# Altium schematic sheet Differentiator.SchDoc
size A; SheetNumber: 6; SheetTotal: 8
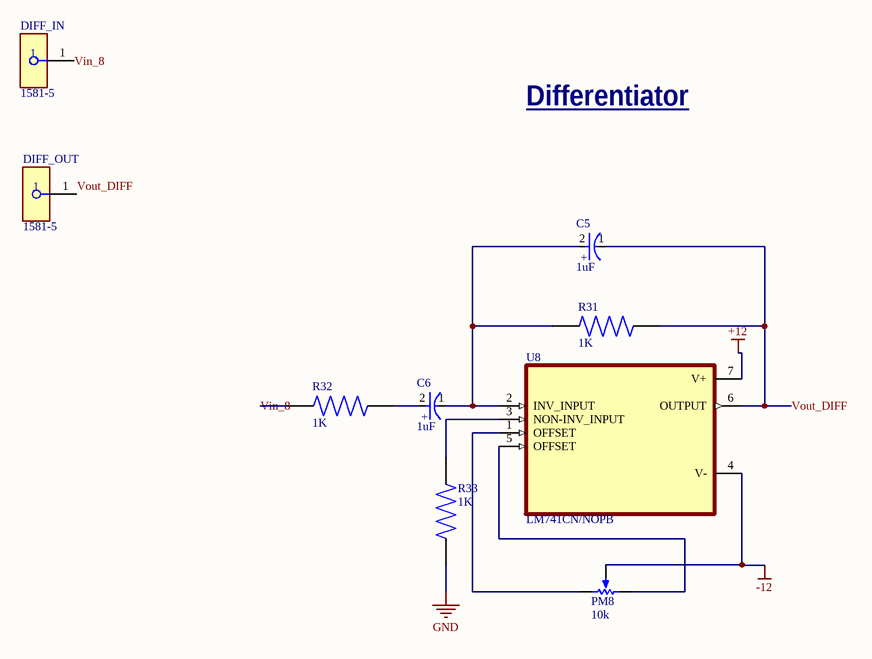
[diagram p0: Differentiator.SchDoc]

## Parts
C5  1uF  [FP-ECA-2CHG010I-MFG]
C6  1uF  [FP-ECA-2CHG010I-MFG]
DIFF_IN  1581-5  [FP-1581-5-MFG]
DIFF_OUT  1581-5  [FP-1581-5-MFG]
PM8  10k  [BOUR-3362P]
R31  1K  [RESAD1100W55L680D260]
R32  1K  [RESAD1100W55L680D260]
R33  1K  [RESAD1100W55L680D260]
U8  LM741CN/NOPB  [DIP794W45P254L959H508Q8]

## Nets
+12: U8.7(V+)
-12: PM8.2(S) U8.4(V-)
GND: R33.1
Vin_8: DIFF_IN.1 R32.1
Vout_DIFF: C5.1(C) DIFF_OUT.1 R31.2 U8.6(OUTPUT)
NetC5_2: C5.2(A) C6.1(C) R31.1 U8.2(INV_INPUT)
NetC6_2: C6.2(A) R32.2
NetPM8_1: PM8.1(CCW) U8.5(OFFSET)
NetPM8_3: PM8.3(CW) U8.1(OFFSET)
NetR33_2: R33.2 U8.3(NON-INV_INPUT)

## Notes on the sheet
- Differentiator
- (in symbol CMP-05427-002176-1) +

## Library data of the parts
C5 C6 = CMP-05427-002176-1: CAP ALUM 1UF 20% 160V RADIAL; Lead/Base Style: Straight; Ripple Current: 17mA; Life (Hours): 2000Hour; Voltage Rating (DC): 160V; Max Operating Temperature: 105°C; Radiation Hardening: No; Min Operating Temperature: -25°C; Packaging: Ammo Pack; Series: NHG; Capacitance: 1uF; Height - Seated (Max): 0.48inch; Lead Pitch: 2.5mm; Diameter: 6.3mm; Length: 11.2mm; Package Quantity: 2000; Termination: Radial; RoHS Compliant: Yes; Voltage Rating: 160V; Tolerance: 20%; Height: 11.2mm; Case/Package: Radial; Mount: Through Hole
DIFF_IN DIFF_OUT = CMP-73906-000011-1: CONN BANANA JACK TURRET GREEN; Body Material: PC; Number of Contacts: 1; Max Current Rating: 15A; Voltage Rating (AC): 30V; Insulation: Mating End Insulated; Voltage Rating: 2.5kV; Voltage Rating (DC): 60V; Gender: Female; Height: 0.25inch; Mount: Panel; RoHS Compliant: Yes; Length: 1.22inch; Orientation: Straight; Diameter: 4.22mm; Lead Free: Lead Free; Package Quantity: 1; Termination: Turret; Current Rating: 15A; Packaging: Bag; Series: 1581; REACH SVHC: No SVHC; Number of Positions: 1; Contact Plating: Tin; Housing Color: Green; Contact Material: Brass; Insulation Material: Polycarbonate; Weight: 0.126lb; Number of Ports: 1; Color: Green; Housing Material: Polycarbonate; Width: 4inch
PM8 = CMP-1747-00004-1: Square Trimpot(R) Trimming Potentiometer, 10 KOhm, 300 V, -55 to 125 degC, 3-Pin THD, RoHS, Tube; Voltage Rating: 220 mV; Power Rating: 1 W; Tolerance: 1%; Resistance: 50 mohm; Case/Package: 1206; Length: 3.2 mm; RoHSCompliant: True; PackageDescription: 3-Pin Through Hole Device, Body 6.6 x 6.99 mm, Pitch 2.54 mm; ComponentLink2Description: Datasheet; REACH SVHC: No SVHC; Mount: Surface Mount; Height: 0.6 mm; Packaging: Tape and Reel; ComponentLink1URL: http://www.bourns.com/; Case Code (Imperial): 0612; Pins: 2; Case Code (Metric): 1632; ComponentLink2URL: http://www.bourns.com/docs/Product-Datasheets/3362.pdf; Min Operating Temperature: -25degC; ComponentLink1Description: Manufacturer URL; PackageReference: 3326P; Max Operating Temperature: 125degC; Width: 1.6 mm; Package Quantity: 5000; DatasheetVersion: May-16
R31-R33 = MFR-25FBF52-1K: 1.07 kOhms Â±1% 0.25W, 1/4W Through Hole Resistor Axial - Metal Film; MF: Yageo; SnapEDA_Link: https://www.snapeda.com/parts/MFR-25FBF52-1K/Yageo/view-part/?ref=snap; Package: RADIAL-2 YAGEO; Value: *; MP: MFR-25FBF52-1K; Check_prices: https://www.snapeda.com/parts/MFR-25FBF52-1K/Yageo/view-part/?ref=eda
U8 = LM741CN/NOPB: Single, 44-V, 1-MHz operational amplifier; MF: Texas Instruments; SnapEDA_Link: https://www.snapeda.com/parts/LM741CN/NOPB/Texas+Instruments/view-part/?ref=snap; Package: PDIP-8 Texas; Value: *; MP: LM741CN/NOPB; Check_prices: https://www.snapeda.com/parts/LM741CN/NOPB/Texas+Instruments/view-part/?ref=eda